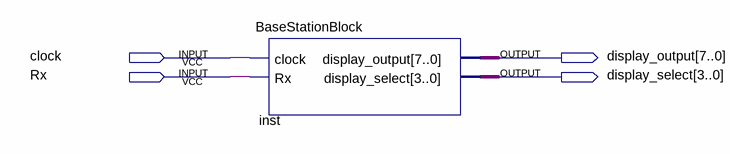
[diagram p0: schematic sheet]
// Quartus schematic BaseStation.bdf as structural Verilog: 1 symbols, 4 pins
module BaseStation (
  input  clock,
  input  Rx,
  output [7:0] display_output,
  output [3:0] display_select
);

  BaseStationBlock inst (.clock(clock), .Rx(Rx), .display_output(display_output), .display_select(display_select));
endmodule
